# EAGLE design equilizerShield (EAGLE 8.2.2)
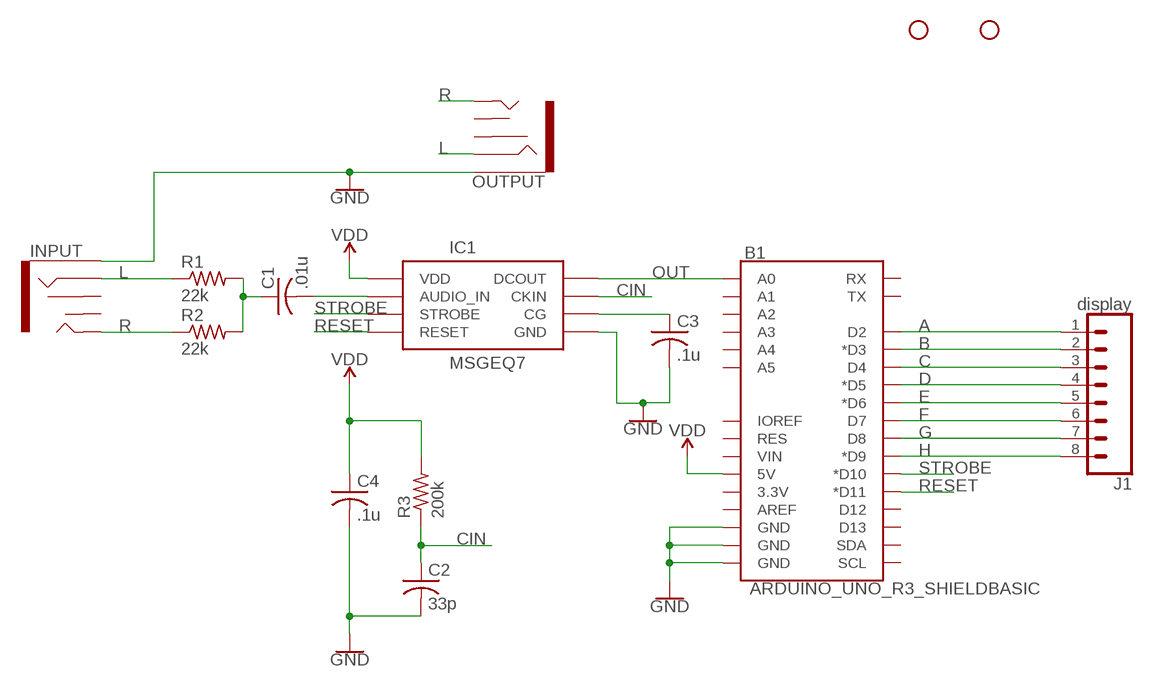
[diagram p0: schematic, sheet 1]

## Parts
B1  ARDUINO_UNO_R3_SHIELDBASIC  [UNO_R3_SHIELD]
C1  .01u  C-USC0805  [C0805]
C2  33p  C-USC0805  [C0805]
C3  .1u  C-USC0805  [C0805]
C4  .1u  C-USC0805  [C0805]
H1  STAND-OFF  [STAND-OFF]
H2  STAND-OFF  [STAND-OFF]
IC1  MSGEQ7P  MSGEQ7DIL  [DIP08]
INPUT  AUDIO_JACK_3.5MM_PTH  [AUDIO-JACK]
J1  display  CONN_08LOCK  [1X08_LOCK]
OUTPUT  AUDIO_JACK_3.5MM_PTH  [AUDIO-JACK]
R1  22k  R-US_R0805  [R0805]
R2  22k  R-US_R0805  [R0805]
R3  200k  R-US_R0805  [R0805]

## Nets
A: B1.D2 J1.1
B: B1.D3(*D3) J1.2
C: B1.D4 J1.3
CIN: C2.1 IC1.8(CKIN) R3.1
D: B1.D5(*D5) J1.4
E: B1.D6(*D6) J1.5
F: B1.D7 J1.6
G: B1.D8 J1.7
GND: B1.GND@0(GND) B1.GND@1(GND) B1.GND@2(GND) C2.2 C3.2 C4.2 IC1.2(GND) INPUT.SLEEVE OUTPUT.SLEEVE
H: B1.D9(*D9) J1.8
L: INPUT.RING OUTPUT.RING R1.1
N$10: C3.1 IC1.6(CG)
N$12: C1.2 IC1.5(AUDIO_IN)
N$13: C1.1 R1.2 R2.2
OUT: B1.A0 IC1.3(DCOUT)
R: INPUT.TIP OUTPUT.TIP R2.1
RESET: B1.D11(*D11) IC1.7(RESET)
STROBE: B1.D10(*D10) IC1.4(STROBE)
VDD: B1.5V C4.1 IC1.1(VDD) R3.2
Unconnected: B1.3.3V B1.A1 B1.A2 B1.A3 B1.A4 B1.A5 B1.AREF B1.D12 B1.D13 B1.IOREF B1.RES B1.RX B1.SCL B1.SDA B1.TX B1.VIN INPUT.RSH INPUT.TSH OUTPUT.RSH OUTPUT.TSH

## Library data of the parts
B1 = SparkFun-Boards:ARDUINO_UNO_R3_SHIELD: Arduino R3 Shield Footprint Shield form compatible with the Arduino Uno R3. SparkFun Products: MG2639 Cellular Shield <https://www.sparkfun.com/products/13120> MIDI Shield <https://www.sparkfun.com/products/12898> R3 Stackable Headers Kit <https://www.sparkfun.com/products/11417>
C1-C4 = rcl:C-US: CAPACITOR, American symbol
H1 H2 = SparkFun-Hardware:STAND-OFF: Stand Off Drill holes for mechanically mounting via screws, standoffs, etc. Note: Use the keepout ring to avoid running the screw head into surrounding components. Variant Overviews STAND-OFF - Mechanical footprint for a #4 phillips button head screw. STAND-OFF-TIGHT - Mechanical footprint for a #4 phillips button head screw, Example SparkFun Products Screw - Phillips Head (1/4", 4-40, 10 pack) <https://www.sparkfun.com/products/10453> (PRT-10453) Screw - Phillips Head (1/2", 4-40, 10 pack) <https://www.sparkfun.com/products/10452> (PRT-10452) Screw - Phillips Head (3/4", 4-40, 10 pack) <https://www.sparkfun.com/products/10451> (PRT-10451) Screw - Phillips Head (1", 4-40, 10 pack) <https://www.sparkfun.com/products/10450> (PRT-10450)
IC1 = SparkFun-IC-Special-Function:MSGEQ7: 7-band graphic equalizer This IC is for making a 7 band/channel audio spectrometer. There are two versions of this part. The DIP available on the storefront, and the SO used in product. Datasheet <https://www.sparkfun.com/datasheets/Components/General/MSGEQ7.pdf> SparkFun Products Storefront component: Graphic Equalizer Display Filter - MSGEQ7 <https://www.sparkfun.com/products/10468> (COM-10468) SparkFun Spectrum Shield <https://www.sparkfun.com/products/13116> (DEV-13116); PROD_ID: IC-12196
INPUT OUTPUT = SparkFun-Connectors:AUDIO_JACK_3.5MM: Audio Jack 3.5mm variants of PTH and SMT stereo audio jack with bypass switches. SparkFun Products: SparkFun SparkPunk Sound Kit <[https://www.sparkfun.com/products/11177]> - PTH MP3 Trigger <https://www.sparkfun.com/products/13720> -3.5mm SMD SparkFun PicoBoard <https://www.sparkfun.com/products/11888>- 2.5mm SMD; PROD_ID: CONN-08774; SF_ID: PRT-08032
J1 = SparkFun-Connectors:CONN_08: Multi connection point. Often used as Generic Header-pin footprint for 0.1 inch spaced/style header connections On any of the 0.1 inch spaced packages, you can populate with these: Break Away Headers - Straight <https://www.sparkfun.com/products/116> (PRT-00116) Break Away Male Headers - Right Angle <https://www.sparkfun.com/products/553> (PRT-00553) Female Headers <https://www.sparkfun.com/products/115> (PRT-00115) Break Away Headers - Machine Pin <https://www.sparkfun.com/products/117> (PRT-00117) Break Away Female Headers - Swiss Machine Pin <https://www.sparkfun.com/products/743> (PRT-00743) Arduino Stackable Header - 8 Pin <https://www.sparkfun.com/products/9279> (PRT-09279) For SCREWTERMINALS and SPRING TERMINALS visit here: Screw Terimnals on SparkFun.com <https://www.sparkfun.com/search/results?term=Screw+Terminals> (5mm/3.5mm/2.54mm spacing) This device is also useful as a general connection point to wire up your design to another part of your project. Our various solder wires solder well into these plated through hole pads. Hook-Up Wire - Assortment (Stranded, 22 AWG) <https://www.sparkfun.com/products/11375> (PRT-11375) Hook-Up Wire - Assortment (Solid Core, 22 AWG) <https://www.sparkfun.com/products/11367> (PRT-11367) View the entire wire category on our website here <https://www.sparkfun.com/categories/141> Special notes: Molex polarized connector foot print use with SKU : PRT-08231 with associated crimp pins and housings. 1MM SMD Version SKU: PRT-10208 NOTES ON THE VARIANTS LOCK and LOCK_LONGPADS... This footprint was designed to help hold the alignment of a through-hole component (i.e. 6-pin header) while soldering it into place. You may notice that each hole has been shifted either up or down by 0.005 of an inch from it's more standard position (which is a perfectly straight line). This slight alteration caused the pins (the squares in the middle) to touch the edges of the holes. Because they are alternating, it causes a "brace" to hold the component in place. 0.005 has proven to be the perfect amount of "off-center" position when using our standard breakaway headers. Although looks a little odd when you look at the bare footprint, once you have a header in there, the alteration is very hard to notice. Also,if you push a header all the way into place, it is covered up entirely on the bottom side.
R1-R3 = resistor:R-US_: RESISTOR, American symbol

## Board
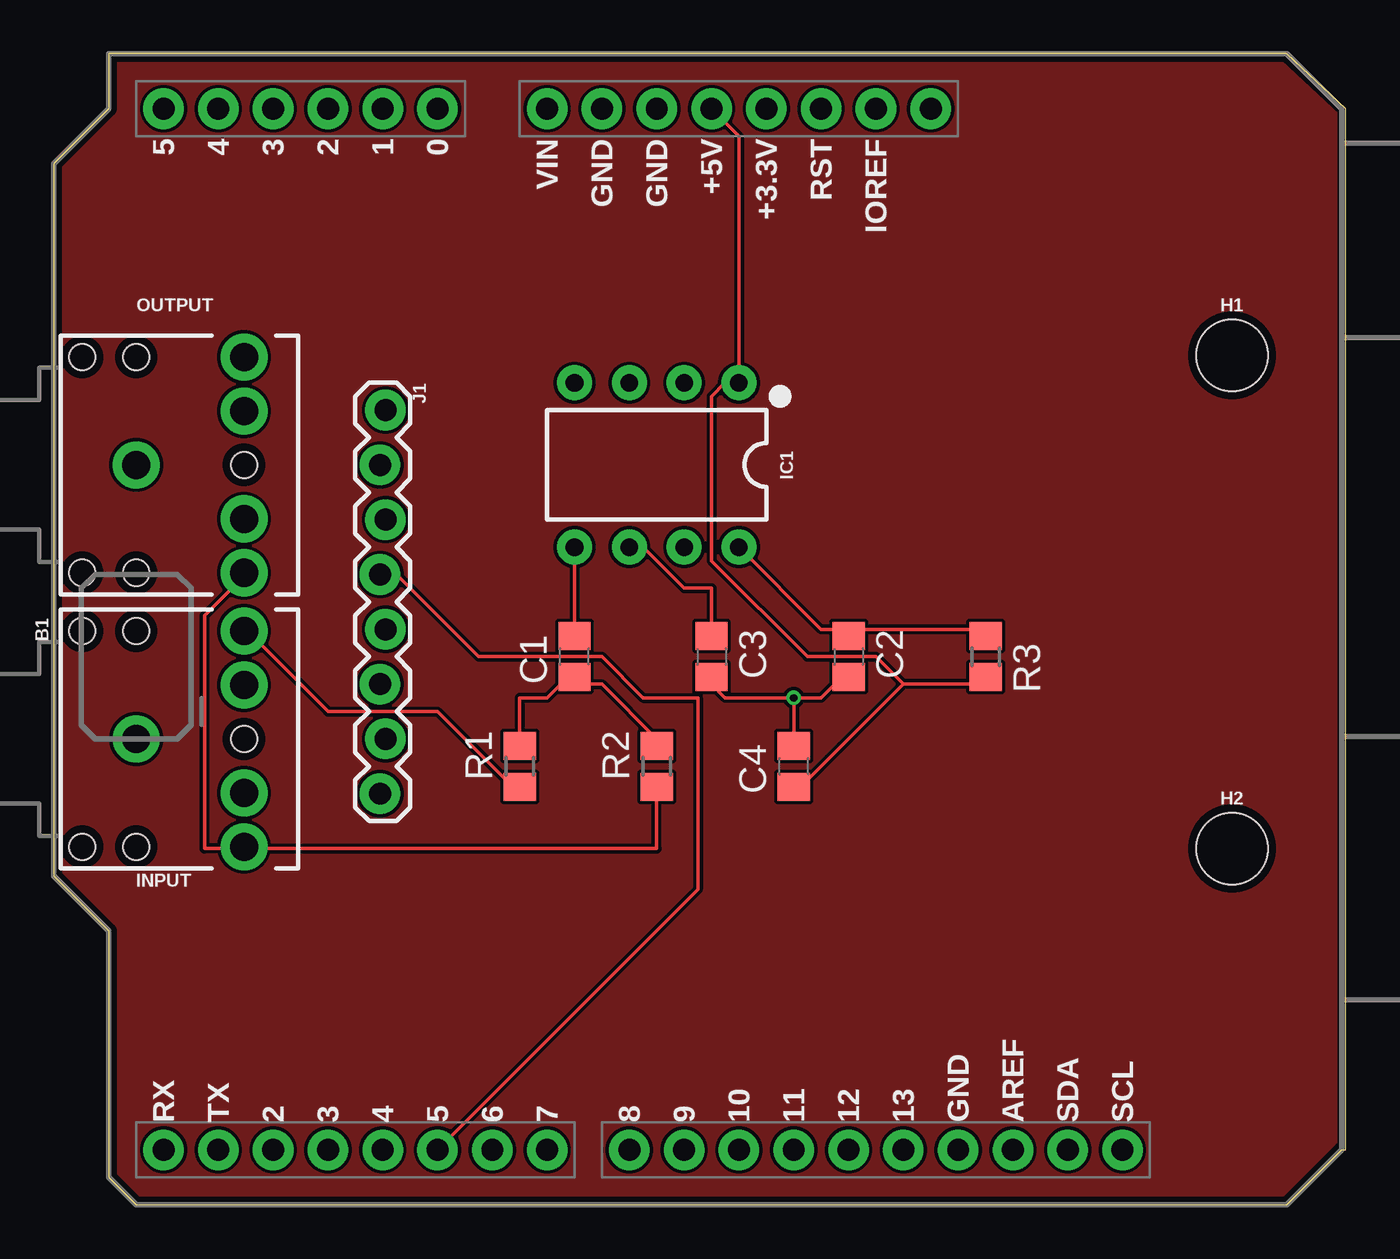
[diagram p1: board, top side]
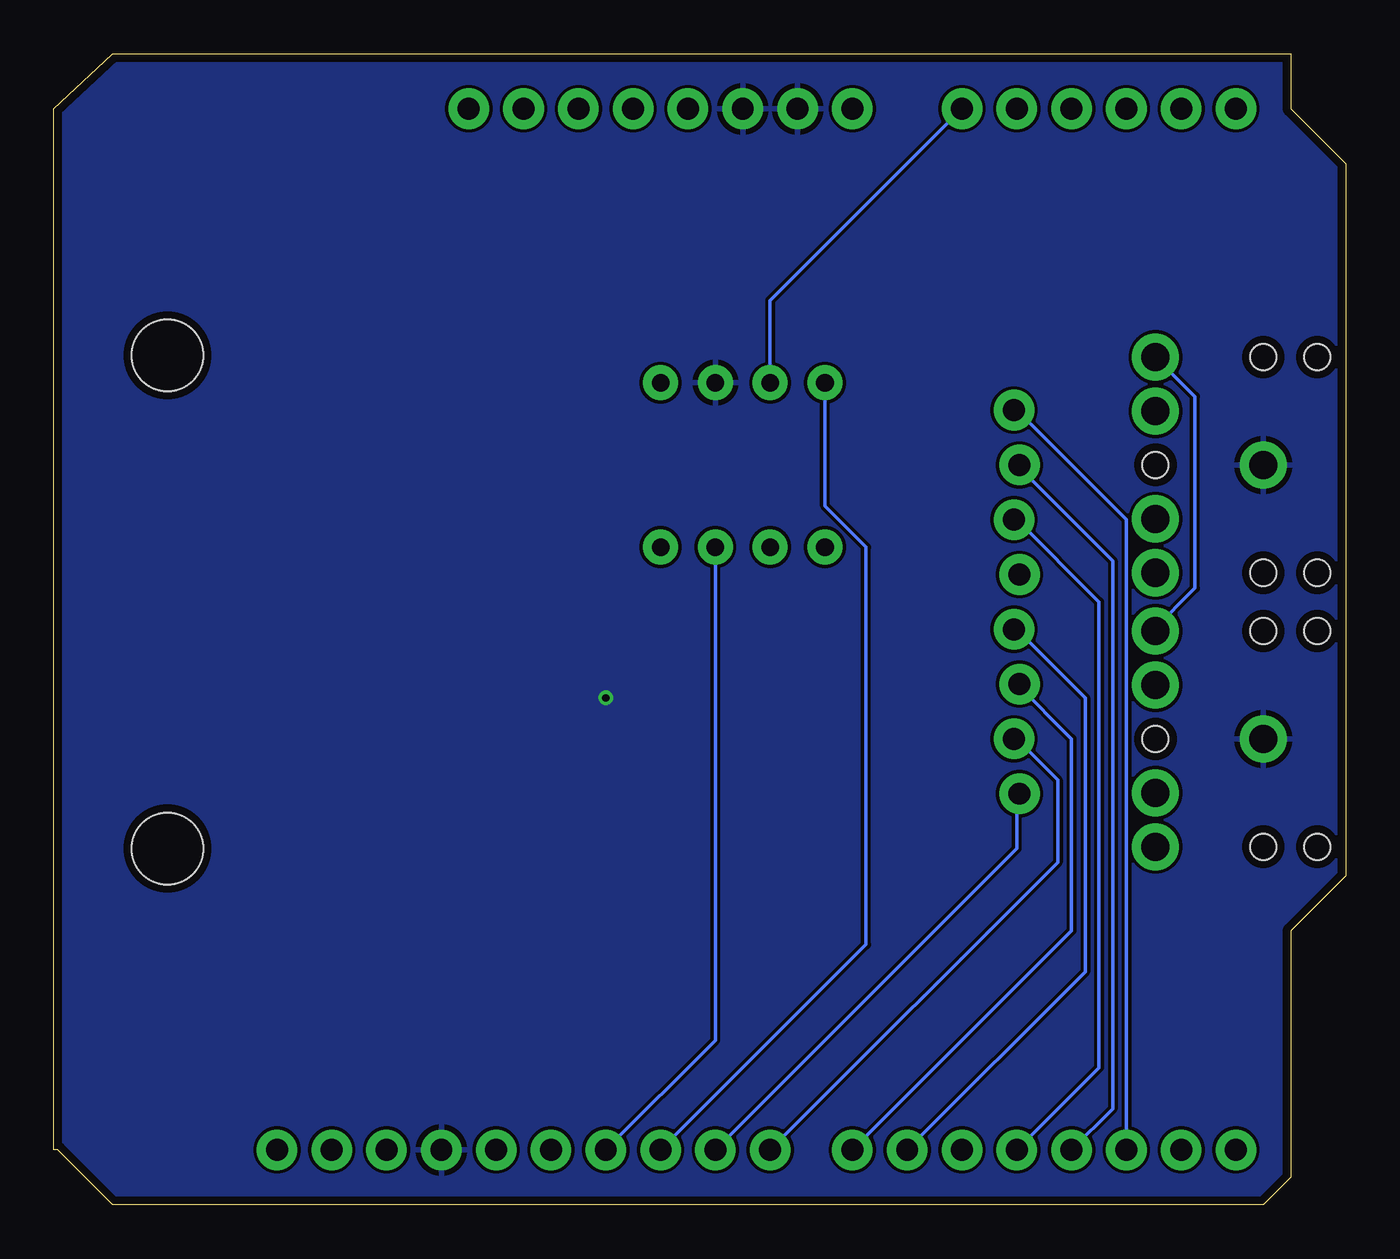
[diagram p2: board, bottom side, seen from below]

Size 59.87 x 53.34 mm. Coordinates in mm from the lower left corner, seen from the top.
Outline: 3.81,0 57.15,0 59.69,2.54 59.87,2.54 59.87,50.79 57.16,53.33 57.15,53.34 2.54,53.34 2.54,50.8 0,48.26 0,15.24 2.54,12.7 2.54,1.27 3.81,0
Copper layers (1*16): Top 0.0356mm / dielectric 1.5011mm / Bottom 0.0356mm
Design rules "LaenPCBOrder": minimum track width 6mil, minimum drill 13mil, track to track 6mil, track to pad 6mil, pad to pad 6mil, via to via 6mil, smd to smd 6mil, copper to edge 15mil, drill to drill 6mil, minimum pad ring 7mil, minimum via ring 7mil, stop-mask expansion 3mil, vias tented up to drill 0mil, thermal gap 10mil

### Footprints (pad centres in the part's own frame; a part is rotated, then mirrored left to right if it is on the bottom)
UNO_R3_SHIELD = drill 1.016 pad 1.88: 3.3V 24.13,-2.54; 5V 24.13,0; A0 24.13,12.7; A1 24.13,15.24; A2 24.13,17.78; A3 24.13,20.32; A4 24.13,22.86; A5 24.13,25.4; AREF -24.13,-13.97; D2 -24.13,20.32; D3 -24.13,17.78; D4 -24.13,15.24; D5 -24.13,12.7; D6 -24.13,10.16; D7 -24.13,7.62; D8 -24.13,3.81; D9 -24.13,1.27; D10 -24.13,-1.27; D11 -24.13,-3.81; D12 -24.13,-6.35; D13 -24.13,-8.89; GND@0 24.13,2.54; GND@1 24.13,5.08; GND@2 -24.13,-11.43; IOREF 24.13,-7.62; NC 24.13,-10.16; RES 24.13,-5.08; RX -24.13,25.4; SCL -24.13,-19.05; SDA -24.13,-16.51; TX -24.13,22.86; VIN 24.13,7.62
C0805 = smd 1.3 x 1.5: 1 -0.95,0; 2 0.95,0
STAND-OFF = hole 3.302: 0,0
DIP08 = drill 0.813 pad 1.626: 1 -3.81,-3.81; 2 -1.27,-3.81; 3 1.27,-3.81; 4 3.81,-3.81; 5 3.81,3.81; 6 1.27,3.81; 7 -1.27,3.81; 8 -3.81,3.81
AUDIO-JACK = drill 1.3 pad 2.184: RING 5,5; RSH 5,2.5; SLEEVE 0,0; TIP 5,-5; TSH 5,-2.5 | hole 1.2: 0,5; -2.5,5; -2.5,-5; 0,-5; 5,0
1X08_LOCK = drill 1.016 pad 1.88: 1 0,0.127; 2 2.54,-0.127; 3 5.08,0.127; 4 7.62,-0.127; 5 10.16,0.127; 6 12.7,-0.127; 7 15.24,0.127; 8 17.78,-0.127
R0805 = smd 1.3 x 1.5: 1 -0.95,0; 2 0.95,0

### Placement (x,y rotation side)
B1  30.48,26.67 90 top
C1  24.13,25.4 90 top
C2  36.83,25.4 270 top
C3  30.48,25.4 270 top
C4  34.29,20.32 90 top
H1  54.61,39.37 0 top
H2  54.61,16.51 0 top
IC1  27.94,34.29 180 top
INPUT  3.81,21.59 0 top
J1  15.24,36.83 270 top
OUTPUT  3.81,34.29 0 top
R1  21.59,20.32 90 top
R2  27.94,20.32 90 top
R3  43.18,25.4 270 top

### Tracks (layer width: path | path; a pad name or v marks a point on that pad's centre or on a via)
A
  Bottom 0.152: B1.D2 10.16,31.75 15.24,36.83 J1.1
B
  Bottom 0.152: B1.D3 10.79,4.45 10.79,29.84 15.24,34.29 J1.2
C
  Bottom 0.152: B1.D4 11.43,6.35 11.43,27.94 15.24,31.75 J1.3
CIN
  Top 0.152: 36.83,26.67 43.18,26.67 R3.1 | IC1.8 35.56,26.67 36.83,26.67 | 36.83,26.67 C2.1
D
  Top 0.152: B1.D5 29.84,14.61 29.84,23.5 27.3,23.5 25.4,25.4 19.68,25.4 15.88,29.21 J1.4
E
  Bottom 0.152: B1.D6 12.06,10.79 12.06,23.5 15.24,26.67 J1.5
F
  Bottom 0.152: B1.D7 12.7,12.7 12.7,21.59 15.24,24.13 J1.6
G
  Bottom 0.152: B1.D8 13.34,15.88 13.34,19.68 15.24,21.59 J1.7
GND  (via drill 0.33)
  Top 0.152: v34.29,23.5 C4.2 | v34.29,23.5 35.56,23.5 36.2,24.13 36.83,24.13 C2.2 | v34.29,23.5 31.11,23.5 30.48,24.13 C3.2
  pour Bottom: 2.54,53.34 57.15,53.34 59.69,50.8 59.69,2.54 57.15,0 3.81,0 2.54,1.27 2.54,12.7 0,15.24 0,48.26 2.54,50.8
H
  Bottom 0.152: B1.D9 15.24,16.51 15.24,19.05 J1.8
L
  Top 0.152: R1.1 21.59,19.68 20.95,19.68 17.78,22.86 12.7,22.86 9.53,26.04 8.89,26.04 INPUT.RING
  Bottom 0.152: OUTPUT.RING 6.99,37.47 6.99,28.57 8.89,26.67 INPUT.RING
N$1
  pour Top: 2.54,53.34 57.15,53.34 59.69,50.8 59.69,2.54 57.15,0 3.81,0 2.54,1.27 2.54,12.7 0,15.24 0,48.26 2.54,50.8
N$10
  Top 0.152: C3.1 30.48,28.57 29.21,28.57 27.3,30.48 IC1.6
N$12
  Top 0.152: IC1.5 C1.2
N$13
  Top 0.152: R1.2 21.59,23.5 22.86,23.5 23.5,24.13 24.13,24.13 | 24.13,24.13 25.4,24.13 27.94,21.59 R2.2 | 24.13,24.13 C1.1
OUT
  Bottom 0.152: IC1.3 26.67,41.91 B1.A0
R
  Top 0.152: R2.1 27.94,16.51 8.89,16.51 INPUT.TIP 8.26,16.51 6.99,16.51 6.99,27.3 8.26,28.57 8.26,29.21 OUTPUT.TIP
RESET
  Bottom 0.152: IC1.7 29.21,7.62 B1.D11
STROBE
  Bottom 0.152: IC1.4 24.13,32.38 22.23,30.48 22.23,12.06 B1.D10
VDD
  Top 0.152: 39.37,24.13 34.92,19.68 34.29,19.68 C4.1 | 39.37,24.13 43.18,24.13 R3.2 | B1.5V 31.75,49.53 IC1.1 31.11,38.1 30.48,37.47 30.48,29.84 34.92,25.4 38.1,25.4 39.37,24.13